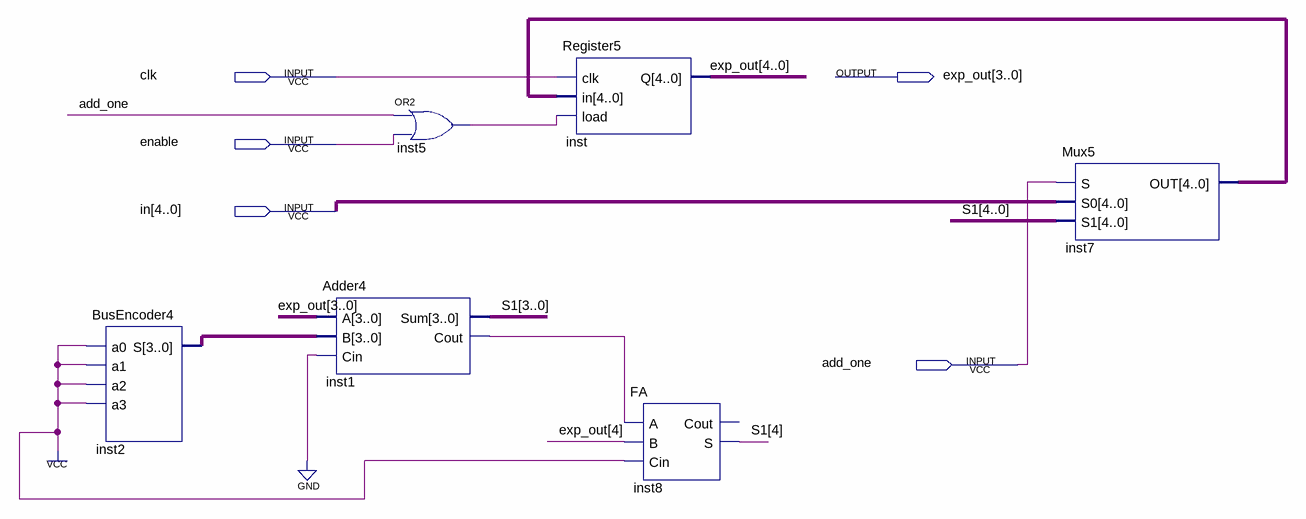
[diagram p0: schematic sheet]
// Quartus schematic exp_register.bdf as structural Verilog: 6 symbols, 5 pins
module exp_register (
  input  clk,
  input  enable,
  input  [4:0] in,
  input  add_one,
  output [4:0] exp_out
);

  wire inst1_cout, inst5_out;
  wire [3:0] inst2_s;
  wire [4:0] inst7_out, S1;

  BusEncoder4 inst2 (.a0(1'b1), .a1(1'b1), .a2(1'b1), .a3(1'b1), .S(inst2_s));
  Adder4 inst1 (.A(exp_out[3:0]), .B(inst2_s), .Cin(1'b0), .Sum(S1[3:0]), .Cout(inst1_cout));
  or inst5 (inst5_out, add_one, enable);
  Register5 inst (.clk(clk), .in(inst7_out), .load(inst5_out), .Q(exp_out));
  FA inst8 (.A(inst1_cout), .B(exp_out[4]), .Cin(1'b1), .S(S1[4]));  // open: Cout
  Mux5 inst7 (.S(add_one), .S0(in), .S1(S1), .OUT(inst7_out));
endmodule
